# EasyEDA schematic SCH_rocket-flight-computer_2025-01-19 (1).json
TITLE: Sheet_1; REV: 1.0; Date: 2024-09-29; Sheet: 1/1; Drawn By: ruihan.zhao13147-bihz; Company: Your Company
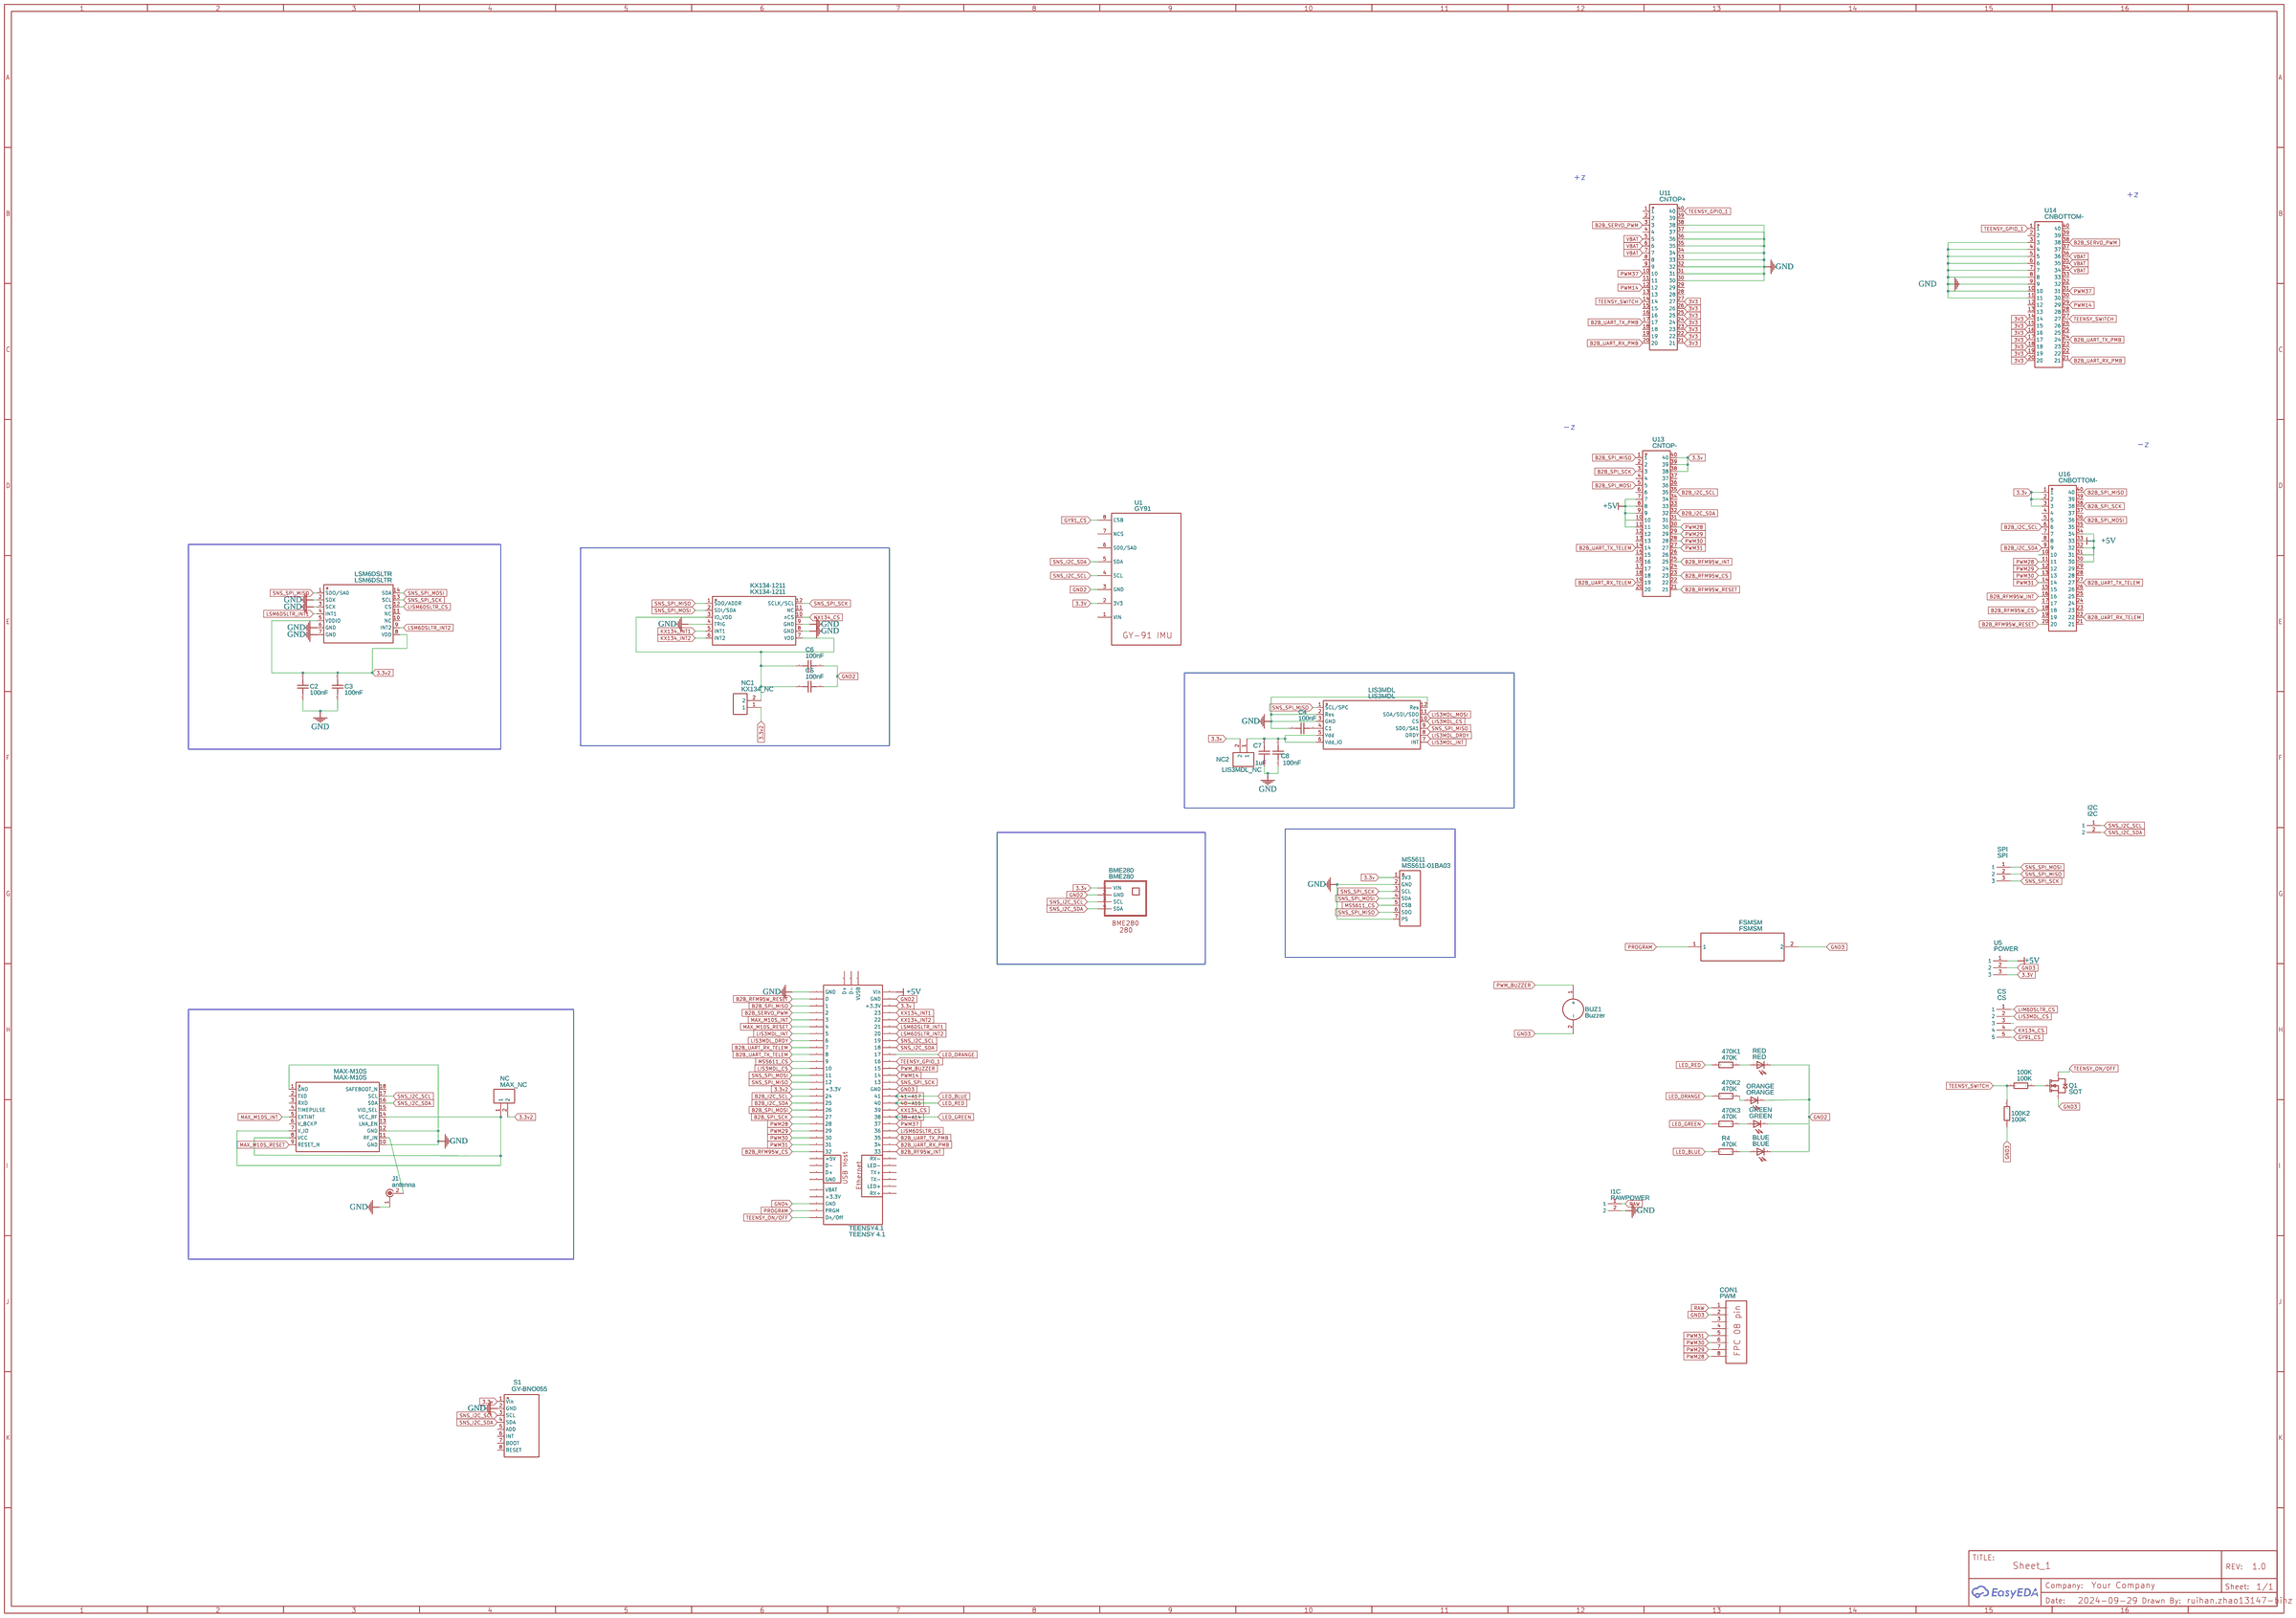
[diagram p0: schematic sheet]

## Parts
100K  100K  [0805 RESISTOR FP]
100K2  100K  [0805 RESISTOR FP]
470K1  470K  [0805 RESISTOR FP]
470K2  470K  [0805 RESISTOR FP]
470K3  470K  [0805 RESISTOR FP]
BLUE  BLUE  [CHIP-LED0805]
BME280  BME280  [BME280]
BUZ1  Buzzer  [BUZZER_0905]
C2  100nF  [C0805]
C3  100nF  [C0805]
C4  100nF  [C0805]
C5  100nF  [C0805]
C6  100nF  [C0805]
C7  1uF  [C0805]
C8  100nF  [C0805]
CON1  PWM  [8PIN FFC CONNECTER 1MM USED IN DRONE]
CS  CS  [1X5-PIN-HEADER-OVAL]
FSMSM  FSMSM  [SWITCH_FSMSM]
GREEN  GREEN  [CHIP-LED0805]
I1C  RAWPOWER  [2 PIN HEADERS (PIN = 2.54)]
I2C  I2C  [2 PIN HEADERS (PIN = 2.54)]
J1  antenna  [MOLEX_734120114_UMC_RF_CONN_VERTICAL]
KX134-1211  KX134-1211  [LGA-12_L2.0-W2.0-P0.50-BL]
LIS3MDL  LIS3MDL  [LGA-12_L2.0-W2.0-P0.50-BL]
LSM6DSLTR  LSM6DSLTR  [LGA-14_L3.0-W2.5-P0.50-TL]
MAX-M10S  MAX-M10S  [GPS-SMD_18P-L10.1-W9.7-P1.10]
MS5611  MS5611-01BA03  [MS5611-GY63]
NC  MAX_NC  [HEADER-2PIN]
NC1  KX134_NC  [HEADER-2PIN]
NC2  LIS3MDL_NC  [HEADER-2PIN]
ORANGE  ORANGE  [CHIP-LED0805]
Q1  SOT  [SOT23-3L]
R4  470K  [0805 RESISTOR FP]
RED  RED  [CHIP-LED0805]
S1  GY-BNO055  [BNO055]
SPI  SPI  [CONNECTOR_PINHEADER_2.54MM:PINHEADER_1X3]
TEENSY4  TEENSY 4.1  [TEENSY-4.1-ALL-PINS]  (section 1)
U1  GY91  [GY-91_MPU9250+BMP280 NO HOLES]
U5  POWER  [CONNECTOR_PINHEADER_2.54MM:PINHEADER_1X3]
U11  CNTOP+  [CONN-SMD_40P-P0.80_SGD-JST-BM-08-2X20P-H18-GB0R02]
U13  CNTOP-  [CONN-SMD_40P-P0.80_SGD-JST-BM-08-2X20P-H18-GB0R02]
U14  CNBOTTOM-  [CONN-SMD_40P-P0.80_SGD-JST-BM-08-2X20P-H18-GB0R02]
U16  CNBOTTOM-  [CONN-SMD_40P-P0.80_SGD-JST-BM-08-2X20P-H18-GB0R02]

## Library data of the parts
100K 100K2 470K1-470K3 R4 = 0805 Resistor: Contributor: Zephyr Computer Systems
BLUE GREEN ORANGE RED = LEDCHIP-LED0805: Contributor: Axelpwm
BME280 = BME280 copy: Contributor: tarasoff.artem
BUZ1 = Buzzer_0905: Contributor: mmaygli
C2-C8 = 0805ZC104KAT2A: Contributor: LCSC; Supplier: LCSC; Supplier Part: C597440; Manufacturer: Kyocera AVX; JLCPCB Part Class: Extended Part
CON1 = FFC-CON-08PIN: Manufacturer Part: ER-CON08HB-2; Contributor: znagy
CS = 5pin header: Contributor: ruihan.zhao13147-bihz
FSMSM = FSMSM: Contributor: marty62
I1C I2C = 2 pin header: Contributor: ruihan.zhao13147-bihz
J1 = 0734120114: Manufacturer: Molex; Contributor: Michael DiTomo
KX134-1211 = KX134-1211: Contributor: LCSC; Supplier: LCSC; Supplier Part: C2157908; Manufacturer: ROHM(罗姆); JLCPCB Part Class: Extended Part
LIS3MDL = LIS3MDLTR: Contributor: LCSC; Supplier: LCSC; Supplier Part: C478483; Manufacturer: ST(意法半导体); JLCPCB Part Class: Extended Part
LSM6DSLTR = LSM6DSLTR: Contributor: gxyeda; Supplier: LCSC; Manufacturer: ST(意法半导体); Supplier Part: C126672; JLCPCB Part Class: Extended Part
MAX-M10S = UBLOX MAX-M10S: Manufacturer: ublox; Contributor: LCSC
MS5611 = GY-63 MS5611-01BA03: Contributor: pedromancano
NC NC1 NC2 = Header-2Pin: Contributor: Torbsi
Q1 = AO3400A_C344010_SOT-23_L2.9-W1.3-P1.90-LS2.4-BR: Name: AO3400A_C344010; Symbol: AO3400A_C344010; Supplier: LCSC; Supplier Part: C344010; Manufacturer: Bourne Semicon (Shenzhen); Manufacturer Part: AO3400A; JLCPCB Part Class: Extended Part; Convert to PCB: yes; Add into BOM: yes; Origin Footprint: SOT-23_L2.9-W1.3-P1.90-LS2.4-BR; Contributor: Fran Quero
S1 = GY-BNO055: Contributor: pedromancano
SPI U5 = 3 pinheader: Contributor: ruihan.zhao13147-bihz
TEENSY4 = TEENSY 4.1 (ALL PINS): Contributor: purpleprawn
U1 = GY91 NO HOLES: Manufacturer Part: MPU9250+BMP280; Supplier: CJMCU; Contributor: poikl.m246
U11 U13 U14 U16 = SGDBM-08-40P: Contributor: LCSC; Supplier: LCSC; Supplier Part: C9900010918; Manufacturer: null; JLCPCB Part Class: Extended Part

## Nets
3.3v: BME280.1(VIN) MS5611.1(3V3) NC2.2 S1.1(Vin) TEENSY4.46(+3.3V) U13.38 U13.39 U13.40 U16.1 U16.2 U16.3
3.3V: U1.2(3V3) U5.3
3.3v2: C2.2 C3.2 LSM6DSLTR.5(VDDIO) LSM6DSLTR.8(VDD) NC.2 NC1.1 TEENSY4.15(+3.3V)
3V3: U11.21 U11.22 U11.23 U11.24 U11.25 U11.26 U11.27 U14.14 U14.15 U14.16 U14.17 U14.18 U14.19 U14.20
+5V: TEENSY4.48(+3.3V) U5.1 U13.7 U13.8 U13.9 U13.10 U13.11 U16.30 U16.31 U16.32 U16.33 U16.34
GND: C2.1 C3.1 C4.1 C7.1 C8.1 I1C.2 J1.1 KX134-1211.4(TRIG) KX134-1211.8(GND) KX134-1211.9(GND) LIS3MDL.2(Res) LIS3MDL.3(GND) LIS3MDL.12(Res) LSM6DSLTR.2(SDX) LSM6DSLTR.3(SCX) LSM6DSLTR.6(GND) LSM6DSLTR.7(GND) MAX-M10S.1(GND) MAX-M10S.10(GND) MAX-M10S.12(GND) MS5611.2(GND) MS5611.7(PS) S1.2(GND) TEENSY4.1(GND) U11.30 U11.31 U11.32 U11.33 U11.34 U11.35 U11.36 U11.37 U11.38 U14.3 U14.4 U14.5 U14.6 U14.7 U14.8 U14.9 U14.10 U14.11
GND2: BME280.2(GND) C5.2 C6.2 GREEN.C ORANGE.C RED.C TEENSY4.47(VBAT) U1.3(GND)
GND3: 100K2.1 BUZ1.2(-) CON1.2 FSMSM.2 Q1.1(S) TEENSY4.34(GND) U5.2
GND4: TEENSY4.49(GND)
VBAT: U11.5 U11.6 U11.7 U14.34 U14.35 U14.36
38-A14: 470K3.1 TEENSY4.30(38)
40-A16: 470K1.1 TEENSY4.32(40)
41-A17: R4.1 TEENSY4.33(41)
B2B_I2C_SCL: TEENSY4.16(24) U13.35 U16.6
B2B_I2C_SDA: TEENSY4.17(25) U13.32 U16.9
B2B_RF95W_INT: TEENSY4.25(33)
B2B_RFM95W_CS: TEENSY4.24(32) U13.23 U16.18
B2B_RFM95W_INT: U13.25 U16.16
B2B_RFM95W_RESET: TEENSY4.2(0) U13.21 U16.20
B2B_SERVO_PWM: TEENSY4.4(2) U11.3 U14.38
B2B_SPI_MISO: TEENSY4.3(1) U13.1 U16.40
B2B_SPI_MOSI: TEENSY4.18(26) U13.5 U16.36
B2B_SPI_SCK: TEENSY4.19(27) U13.3 U16.38
B2B_UART_RX_PMB: TEENSY4.26(34) U11.20 U14.21
B2B_UART_RX_TELEM: TEENSY4.9(7) U13.19 U16.22
B2B_UART_TX_PMB: TEENSY4.27(35) U11.17 U14.24
B2B_UART_TX_TELEM: TEENSY4.10(8) U13.14 U16.27
GY91_CS: CS.5 U1.8(CSB)
KX134_CS: CS.4 KX134-1211.10(nCS) TEENSY4.31(39)
KX134_INT1: KX134-1211.5(INT1) TEENSY4.45(23)
KX134_INT2: KX134-1211.6(INT2) TEENSY4.44(22)
LED_ORANGE: 470K2.1 TEENSY4.39(17)
LIM6DSLTR_CS: CS.1
LIS3MDL_CS: CS.2 LIS3MDL.10(CS) TEENSY4.12(10)
LIS3MDL_DRDY: LIS3MDL.8(DRDY) TEENSY4.8(6)
LIS3MDL_INT: LIS3MDL.7(INT) TEENSY4.7(5)
LIS3MDL_MOSI: LIS3MDL.11(SDA/SDI/SDO)
LISM6DSLTR_CS: LSM6DSLTR.12(CS) TEENSY4.28(36)
LSM6DSLTR_INT1: LSM6DSLTR.4(INT1) TEENSY4.43(21)
LSM6DSLTR_INT2: LSM6DSLTR.9(INT2) TEENSY4.42(+5V)
MAX_M10S_INT: MAX-M10S.5(EXTINT) TEENSY4.5(3)
MAX_M10S_RESET: MAX-M10S.9(RESET_N) TEENSY4.6(4)
MS5611_CS: MS5611.5(CSB) TEENSY4.11(9)
PROGRAM: FSMSM.1 TEENSY4.50(PRGM)
PWM14: TEENSY4.36(14) U11.12 U14.29
PWM28: CON1.8 TEENSY4.20(28) U13.30 U16.11
PWM29: CON1.7 TEENSY4.21(29) U13.29 U16.12
PWM30: CON1.6 TEENSY4.22(30) U13.28 U16.13
PWM31: CON1.5 TEENSY4.23(31) U13.27 U16.14
PWM37: TEENSY4.29(37) U11.10 U14.31
PWM_BUZZER: BUZ1.1(+) TEENSY4.37(15)
RAW: CON1.1 I1C.1
SNS_I2C_SCL: BME280.3(SCL) I2C.1 MAX-M10S.17(SCL) S1.3(SCL) TEENSY4.41(19) U1.4(SCL)
SNS_I2C_SDA: BME280.4(SDA) I2C.2 MAX-M10S.16(SDA) S1.4(SDA) TEENSY4.40(18) U1.5(SDA)
SNS_SPI_MISO: KX134-1211.1(SDO/ADDR) LIS3MDL.1(SCL/SPC) LIS3MDL.9(SD0/SA1) LSM6DSLTR.1(SDO/SA0) MS5611.6(SDO) SPI.2 TEENSY4.14(12)
SNS_SPI_MOSI: KX134-1211.2(SDI/SDA) LSM6DSLTR.14(SDA) MS5611.4(SDA) SPI.1 TEENSY4.13(11)
SNS_SPI_SCK: KX134-1211.12(SCLK/SCL) LSM6DSLTR.13(SCL) MS5611.3(SCL) SPI.3 TEENSY4.35(13)
TEENSY_GPIO_1: TEENSY4.38(16) U11.40 U14.1
TEENSY_ON/OFF: Q1.2(D) TEENSY4.51(On/Off)
TEENSY_SWITCH: 100K.1 100K2.2 U11.14 U14.27
Net-(100K-2): 100K.2 Q1.3(G)
Net-(470K1-2): 470K1.2 RED.A
Net-(470K2-2): 470K2.2 ORANGE.A
Net-(470K3-2): 470K3.2 GREEN.A
Net-(BLUE-A): BLUE.A R4.2
Net-(C4-2): C4.2 LIS3MDL.4(C1)
Net-(C5-1): C5.1 C6.1 KX134-1211.3(IO_VDD) KX134-1211.7(VDD) NC1.2
Net-(C7-2): C7.2 C8.2 LIS3MDL.5(Vdd) LIS3MDL.6(Vdd_IO) NC2.1
Net-(J1-2): J1.2 MAX-M10S.11(RF_IN)
Net-(MAX-M10S-7): MAX-M10S.7(V_IO) MAX-M10S.8(VCC) MAX-M10S.14(VCC_RF) NC.1

Not connected (* = marked no-connect by the designer): BLUE C; CON1 3 4; CS 3; KX134-1211 11(NC); LSM6DSLTR 10(NC) 11(NC); MAX-M10S 2(TXD) 3(RXD) 4(TIMEPULSE) 6(V_BCKP) 13(LNA_EN) 15(VIO_SEL) 18(SAFEBOOT_N); S1 5(ADD) 6(INT) 7(BOOT) 8(RESET); TEENSY4 52(VUSB) 60(RX+) 61(LED+) 62(TX-) 63(TX+) 64(LED-) 65(RX-) 66(D+) 67(D-); U1 1(VIN) 6(SD0/SA0) 7(NCS); U11 1 2 4 8 9 11 13 15 16 18 19 28 29 39; U13 2 4 6 12 13 15 16 17 18 20 22 24 26 31 33 34 36 37; U14 2 12 13 22 23 25 26 28 30 32 33 37 39 40; U16 4 5 7 8 10 15 17 19 21 23 24 25 26 28 29 35 37 39

## Notes on the sheet
- +z
- +z
- -z
- -z
